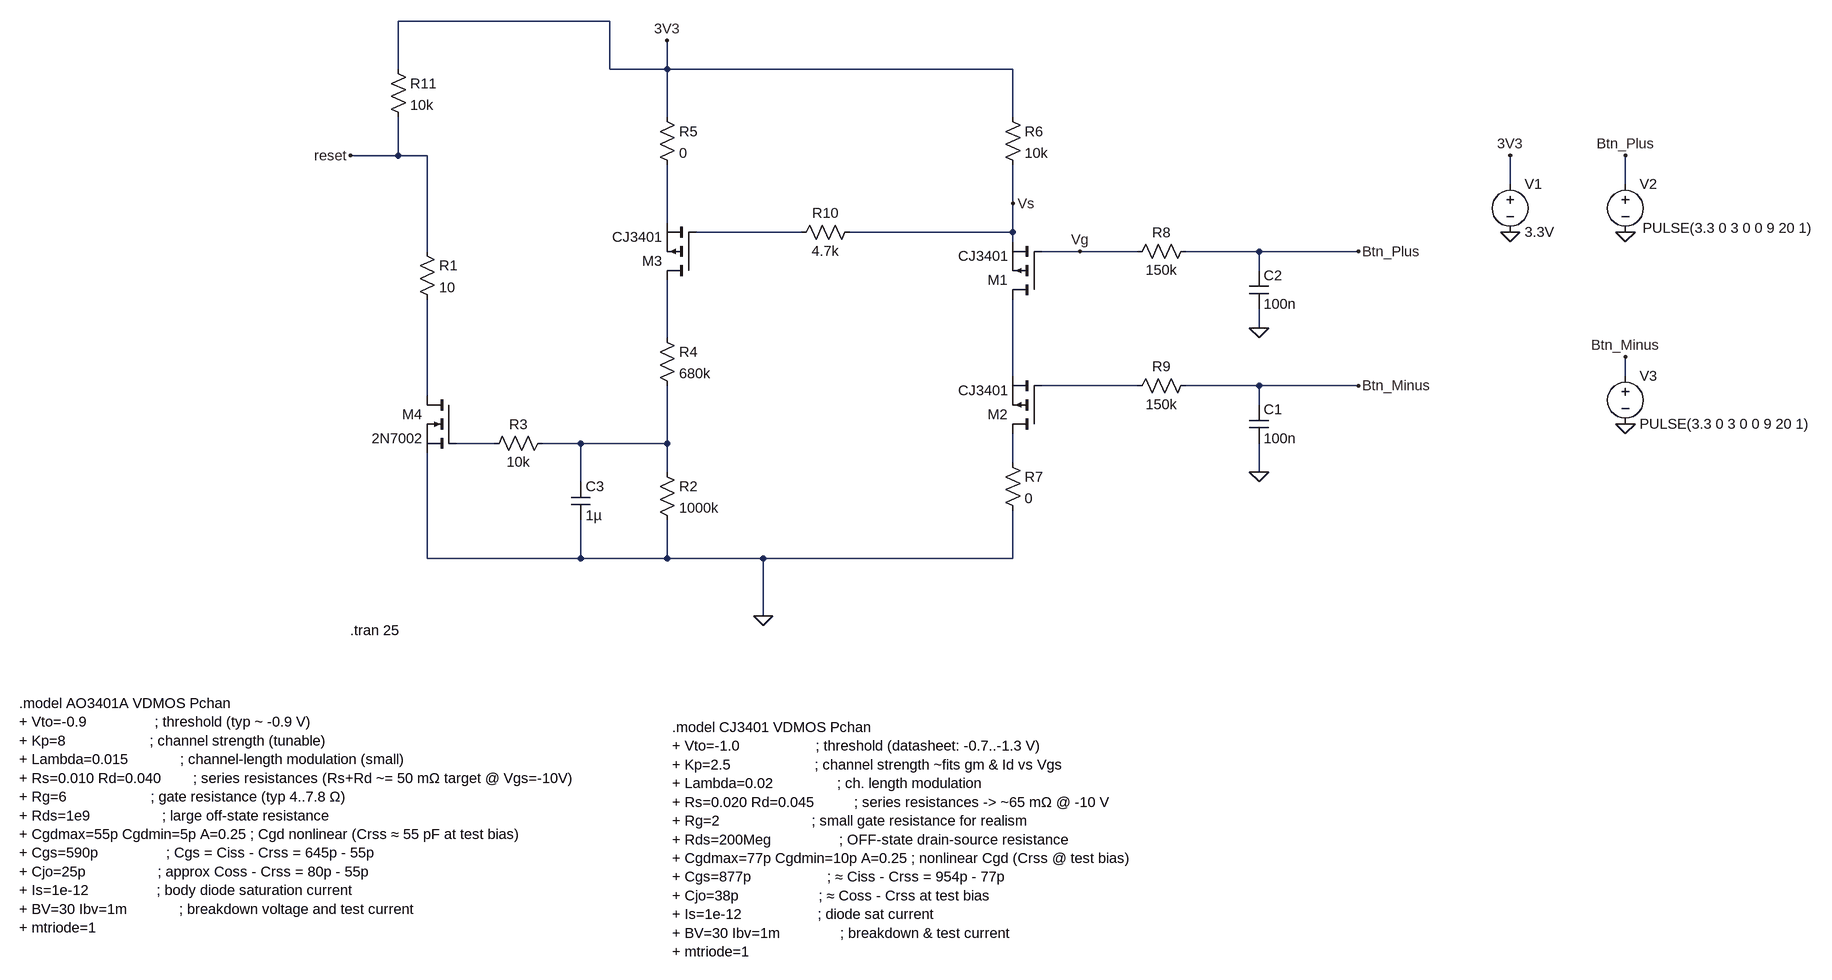
[diagram p0: schematic rstBtn_5s.asc]
rstBtn_5s.asc, the LTspice schematic file:
Version 4
SHEET 1 2136 1424
WIRE -416 -224 -768 -224
WIRE -768 -144 -768 -224
WIRE -416 -144 -416 -224
WIRE -320 -144 -320 -192
WIRE -320 -144 -416 -144
WIRE 256 -144 -320 -144
WIRE -320 -64 -320 -144
WIRE 256 -64 256 -144
WIRE -768 0 -768 -64
WIRE -768 0 -848 0
WIRE -720 0 -768 0
WIRE 1440 48 1440 0
WIRE 1632 48 1632 0
WIRE 256 80 256 16
WIRE -320 112 -320 16
WIRE -96 128 -272 128
WIRE 256 128 256 80
WIRE 256 128 -16 128
WIRE 256 144 256 128
WIRE -720 160 -720 0
WIRE 368 160 304 160
WIRE 464 160 368 160
WIRE 768 160 544 160
WIRE 944 160 768 160
WIRE 768 192 768 160
WIRE 768 288 768 256
WIRE -320 304 -320 208
WIRE 256 368 256 240
WIRE 1632 368 1632 336
WIRE 464 384 304 384
WIRE 768 384 544 384
WIRE 944 384 768 384
WIRE -720 400 -720 240
WIRE 768 416 768 384
WIRE -608 480 -672 480
WIRE -464 480 -528 480
WIRE -320 480 -320 384
WIRE -320 480 -464 480
WIRE 256 512 256 464
WIRE -320 528 -320 480
WIRE 768 528 768 480
WIRE -464 544 -464 480
WIRE -720 672 -720 496
WIRE -464 672 -464 608
WIRE -464 672 -720 672
WIRE -320 672 -320 608
WIRE -320 672 -464 672
WIRE -160 672 -320 672
WIRE 256 672 256 592
WIRE 256 672 -160 672
WIRE -160 768 -160 672
FLAG 768 528 0
FLAG -160 768 0
FLAG 768 288 0
FLAG 1440 128 0
FLAG 1632 128 0
FLAG 1632 448 0
FLAG 1440 0 3V3
FLAG 1632 0 Btn_Plus
FLAG 1632 336 Btn_Minus
FLAG -320 -192 3V3
FLAG 944 160 Btn_Plus
FLAG 944 384 Btn_Minus
FLAG -848 0 reset
FLAG 368 160 Vg
FLAG 256 80 Vs
SYMBOL nmos -672 400 M0
SYMATTR InstName M4
SYMATTR Value 2N7002
SYMBOL res -736 144 R0
SYMATTR InstName R1
SYMATTR Value 10
SYMBOL res -336 512 R0
SYMATTR InstName R2
SYMATTR Value 1000k
SYMBOL res -512 464 R90
WINDOW 0 0 56 VBottom 2
WINDOW 3 32 56 VTop 2
SYMATTR InstName R3
SYMATTR Value 10k
SYMBOL res -336 288 R0
SYMATTR InstName R4
SYMATTR Value 680k
SYMBOL res -336 -80 R0
SYMATTR InstName R5
SYMATTR Value 0
SYMBOL res 240 -80 R0
SYMATTR InstName R6
SYMATTR Value 10k
SYMBOL res 240 496 R0
SYMATTR InstName R7
SYMATTR Value 0
SYMBOL res 560 144 R90
WINDOW 0 0 56 VBottom 2
WINDOW 3 32 56 VTop 2
SYMATTR InstName R8
SYMATTR Value 150k
SYMBOL res 560 368 R90
WINDOW 0 0 56 VBottom 2
WINDOW 3 32 56 VTop 2
SYMATTR InstName R9
SYMATTR Value 150k
SYMBOL res 0 112 R90
WINDOW 0 0 56 VBottom 2
WINDOW 3 32 56 VTop 2
SYMATTR InstName R10
SYMATTR Value 4.7k
SYMBOL cap 752 416 R0
SYMATTR InstName C1
SYMATTR Value 100n
SYMBOL cap 752 192 R0
SYMATTR InstName C2
SYMATTR Value 100n
SYMBOL cap -480 544 R0
SYMATTR InstName C3
SYMATTR Value 1µ
SYMBOL voltage 1440 32 R0
WINDOW 123 0 0 Left 0
WINDOW 39 0 0 Left 0
SYMATTR InstName V1
SYMATTR Value 3.3V
SYMBOL voltage 1632 32 R0
WINDOW 3 29 89 Left 2
WINDOW 123 0 0 Left 0
WINDOW 39 0 0 Left 0
SYMATTR Value PULSE(3.3 0 3 0 0 9 20 1)
SYMATTR InstName V2
SYMBOL voltage 1632 352 R0
WINDOW 123 0 0 Left 0
WINDOW 39 0 0 Left 0
SYMATTR InstName V3
SYMATTR Value PULSE(3.3 0 3 0 0 9 20 1)
SYMBOL res -784 -160 R0
SYMATTR InstName R11
SYMATTR Value 10k
SYMBOL pmos 304 240 R180
SYMATTR InstName M1
SYMATTR Value CJ3401
SYMBOL pmos 304 464 R180
SYMATTR InstName M2
SYMATTR Value CJ3401
SYMBOL pmos -272 208 R180
SYMATTR InstName M3
SYMATTR Value CJ3401
TEXT -848 792 Left 2 !.tran 25
TEXT -312 1072 Left 2 !.model CJ3401 VDMOS Pchan\n+ Vto=-1.0                   ; threshold (datasheet: -0.7..-1.3 V)\n+ Kp=2.5                     ; channel strength ~fits gm & Id vs Vgs\n+ Lambda=0.02                ; ch. length modulation\n+ Rs=0.020 Rd=0.045          ; series resistances -> ~65 mΩ @ -10 V\n+ Rg=2                       ; small gate resistance for realism\n+ Rds=200Meg                 ; OFF-state drain-source resistance\n+ Cgdmax=77p Cgdmin=10p A=0.25 ; nonlinear Cgd (Crss @ test bias)\n+ Cgs=877p                   ; ≈ Ciss - Crss = 954p - 77p\n+ Cjo=38p                    ; ≈ Coss - Crss at test bias\n+ Is=1e-12                   ; diode sat current\n+ BV=30 Ibv=1m               ; breakdown & test current\n+ mtriode=1
TEXT -1400 1032 Left 2 !.model AO3401A VDMOS Pchan\n+ Vto=-0.9                 ; threshold (typ ~ -0.9 V)\n+ Kp=8                     ; channel strength (tunable)\n+ Lambda=0.015             ; channel-length modulation (small)\n+ Rs=0.010 Rd=0.040        ; series resistances (Rs+Rd ~= 50 mΩ target @ Vgs=-10V)\n+ Rg=6                     ; gate resistance (typ 4..7.8 Ω)\n+ Rds=1e9                  ; large off-state resistance\n+ Cgdmax=55p Cgdmin=5p A=0.25 ; Cgd nonlinear (Crss ≈ 55 pF at test bias)\n+ Cgs=590p                 ; Cgs = Ciss - Crss = 645p - 55p\n+ Cjo=25p                  ; approx Coss - Crss = 80p - 55p\n+ Is=1e-12                 ; body diode saturation current\n+ BV=30 Ibv=1m             ; breakdown voltage and test current\n+ mtriode=1

The netlist it stands for:
* rstBtn_5s.asc
M4 N006 N007 0 0 2N7002
R1 reset N006 10
R2 N008 0 1000k
R3 N008 N007 10k
R4 N003 N008 680k
R5 3V3 N001 0
R6 3V3 Vs 10k
R7 N009 0 0
R8 Btn_Plus Vg 150k
R9 Btn_Minus N005 150k
R10 Vs N002 4.7k
C1 Btn_Minus 0 100n
C2 Btn_Plus 0 100n
C3 N008 0 1µ
V1 3V3 0 3.3V
V2 Btn_Plus 0 PULSE(3.3 0 3 0 0 9 20 1)
V3 Btn_Minus 0 PULSE(3.3 0 3 0 0 9 20 1)
R11 3V3 reset 10k
M1 N004 Vg Vs Vs CJ3401
M2 N009 N005 N004 N004 CJ3401
M3 N003 N002 N001 N001 CJ3401
.model NMOS NMOS
.model PMOS PMOS
.lib standard.mos
.tran 25
.model CJ3401 VDMOS Pchan
+ Vto=-1.0                   ; threshold (datasheet: -0.7..-1.3 V)
+ Kp=2.5                     ; channel strength ~fits gm & Id vs Vgs
+ Lambda=0.02                ; ch. length modulation
+ Rs=0.020 Rd=0.045          ; series resistances -> ~65 mΩ @ -10 V
+ Rg=2                       ; small gate resistance for realism
+ Rds=200Meg                 ; OFF-state drain-source resistance
+ Cgdmax=77p Cgdmin=10p A=0.25 ; nonlinear Cgd (Crss @ test bias)
+ Cgs=877p                   ; ≈ Ciss - Crss = 954p - 77p
+ Cjo=38p                    ; ≈ Coss - Crss at test bias
+ Is=1e-12                   ; diode sat current
+ BV=30 Ibv=1m               ; breakdown & test current
+ mtriode=1
.model AO3401A VDMOS Pchan
+ Vto=-0.9                 ; threshold (typ ~ -0.9 V)
+ Kp=8                     ; channel strength (tunable)
+ Lambda=0.015             ; channel-length modulation (small)
+ Rs=0.010 Rd=0.040        ; series resistances (Rs+Rd ~= 50 mΩ target @ Vgs=-10V)
+ Rg=6                     ; gate resistance (typ 4..7.8 Ω)
+ Rds=1e9                  ; large off-state resistance
+ Cgdmax=55p Cgdmin=5p A=0.25 ; Cgd nonlinear (Crss ≈ 55 pF at test bias)
+ Cgs=590p                 ; Cgs = Ciss - Crss = 645p - 55p
+ Cjo=25p                  ; approx Coss - Crss = 80p - 55p
+ Is=1e-12                 ; body diode saturation current
+ BV=30 Ibv=1m             ; breakdown voltage and test current
+ mtriode=1
.backanno
.end